# EAGLE design Attiny43u_devboard (EAGLE 6.4)
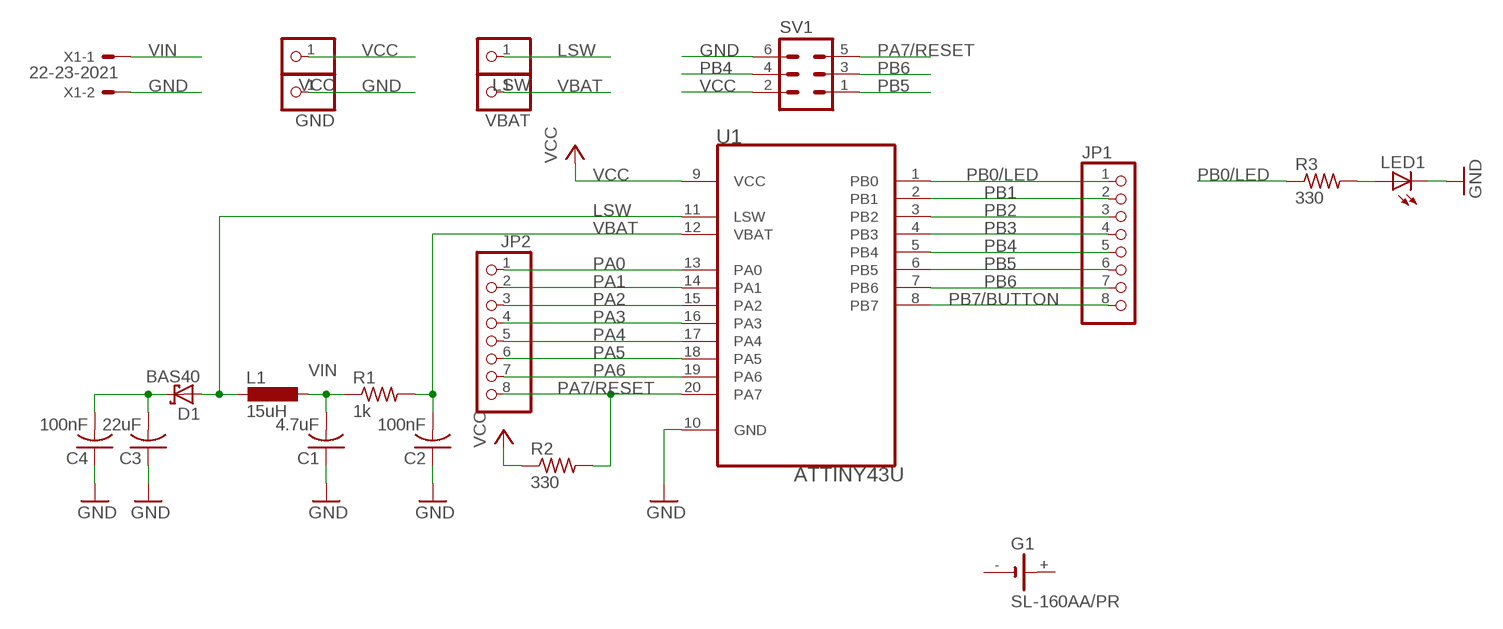
[diagram p0: schematic, sheet 1]

## Parts
C1  4.7uF  C-USC1206K  [C1206K]
C2  100nF  C-USC1206K  [C1206K]
C3  22uF  C-USC1206K  [C1206K]
C4  100nF  C-USC1206K  [C1206K]
D1  BAS40  [SOT23]
G1  SL-160AA/PR  [SL-160AA/PR]
GND  PINHD-1X1  [1X01]
JP1  PINHD-1X8  [1X08]
JP2  PINHD-1X8  [1X08]
L1  15uH  L-EUL3225M  [L3225M]
LED1  LEDCHIPLED_1206  [CHIPLED_1206]
LSW  PINHD-1X1  [1X01]
R1  1k  R-US_M1206  [M1206]
R2  330  R-US_M1206  [M1206]
R3  330  R-US_M1206  [M1206]
SV1  MA03-2  [MA03-2]
U1  ATTINY43U  ATTINY43U-SU  [SOIC127P1032X265-20N]
VBAT  PINHD-1X1  [1X01]
VCC  PINHD-1X1  [1X01]
X1  22-23-2021  [22-23-2021]

## Nets
GND: C1.1 C2.1 C3.1 C4.1 GND.1 LED1.C SV1.6 U1.10(GND) X1.2
LSW: D1.1(A) L1.2 LSW.1 U1.11(LSW)
N$1: LED1.A R3.2
N$2: C3.2 C4.2 D1.3(C)
PA0: JP2.1 U1.13(PA0)
PA1: JP2.2 U1.14(PA1)
PA2: JP2.3 U1.15(PA2)
PA3: JP2.4 U1.16(PA3)
PA4: JP2.5 U1.17(PA4)
PA5: JP2.6 U1.18(PA5)
PA6: JP2.7 U1.19(PA6)
PA7/RESET: JP2.8 R2.2 SV1.5 U1.20(PA7)
PB0/LED: JP1.1 R3.1 U1.1(PB0)
PB1: JP1.2 U1.2(PB1)
PB2: JP1.3 U1.3(PB2)
PB3: JP1.4 U1.4(PB3)
PB4: JP1.5 SV1.4 U1.5(PB4)
PB5: JP1.6 SV1.1 U1.6(PB5)
PB6: JP1.7 SV1.3 U1.7(PB6)
PB7/BUTTON: JP1.8 U1.8(PB7)
VBAT: C2.2 R1.2 U1.12(VBAT) VBAT.1
VCC: R2.1 SV1.2 U1.9(VCC) VCC.1
VIN: C1.2 L1.1 R1.1 X1.1
Unconnected: G1.+ G1.-

## Library data of the parts
C1-C4 = adafruit:C-US: CAPACITOR, American symbol
D1 = diode:BAS40: Silicon Schottky Diodes General-purpose diode for high-speed switching
G1 = battery:SL-160AA/PR: LI BATTERY Sonnenschein
GND LSW VBAT VCC = pinhead:PINHD-1X1: PIN HEADER
JP1 JP2 = pinhead:PINHD-1X8: PIN HEADER
L1 = resistor:L-EU: INDUCTOR, European symbol
LED1 = adafruit:LED: LED OSRAM: - CHIPLED LG R971, LG N971, LY N971, LG Q971, LY Q971, LO R971, LY R971 LH N974, LH R974 LS Q976, LO Q976, LY Q976 LO Q996 - Hyper CHIPLED LW Q18S LB Q993, LB Q99A, LB R99A - SideLED LS A670, LO A670, LY A670, LG A670, LP A670 LB A673, LV A673, LT A673, LW A673 LH A674 LY A675 LS A676, LA A676, LO A676, LY A676, LW A676 LS A679, LY A679, LG A679 - Hyper Micro SIDELED® LS Y876, LA Y876, LO Y876, LY Y876 LT Y87S - SmartLED LW L88C, LW L88S LB L89C, LB L89S, LG L890 LS L89K, LO L89K, LY L89K LS L896, LA L896, LO L896, LY L896 - TOPLED LS T670, LO T670, LY T670, LG T670, LP T670 LSG T670, LSP T670, LSY T670, LOP T670, LYG T670 LG T671, LOG T671, LSG T671 LB T673, LV T673, LT T673, LW T673 LH T674 LS T676, LA T676, LO T676, LY T676, LB T676, LH T676, LSB T676, LW T676 LB T67C, LV T67C, LT T67C, LS T67K, LO T67K, LY T67K, LW E67C LS E67B, LA E67B, LO E67B, LY E67B, LB E67C, LV E67C, LT E67C LW T67C LS T679, LY T679, LG T679 LS T770, LO T770, LY T770, LG T770, LP T770 LB T773, LV T773, LT T773, LW T773 LH T774 LS E675, LA E675, LY E675, LS T675 LS T776, LA T776, LO T776, LY T776, LB T776 LHGB T686 LT T68C, LB T68C - Hyper Mini TOPLED® LB M676 - Mini TOPLED Santana® LG M470 LS M47K, LO M47K, LY M47K Source: http://www.osram.convergy.de/
R1-R3 = adafruit:R-US_: RESISTOR, American symbol
SV1 = con-lstb:MA03-2: PIN HEADER; OC_FARNELL: unknown; OC_NEWARK: unknown
U1 = Atmel_By_element14_Batch_1:ATTINY43U-SU: 8-bit Microcontroller with In-System Programmable Flash and Boost Converter; MPN: ATTINY43U-SU; OC_FARNELL: 1841623; OC_NEWARK: 12T1338; PACKAGE: SOIC-20; SUPPLIER: Atmel
X1 = con-molex:22-23-2021: .100" (2.54mm) Center Header - 2 Pin; MF: MOLEX; MPN: 22-23-2021; OC_FARNELL: 1462926; OC_NEWARK: 25C3832

## Board
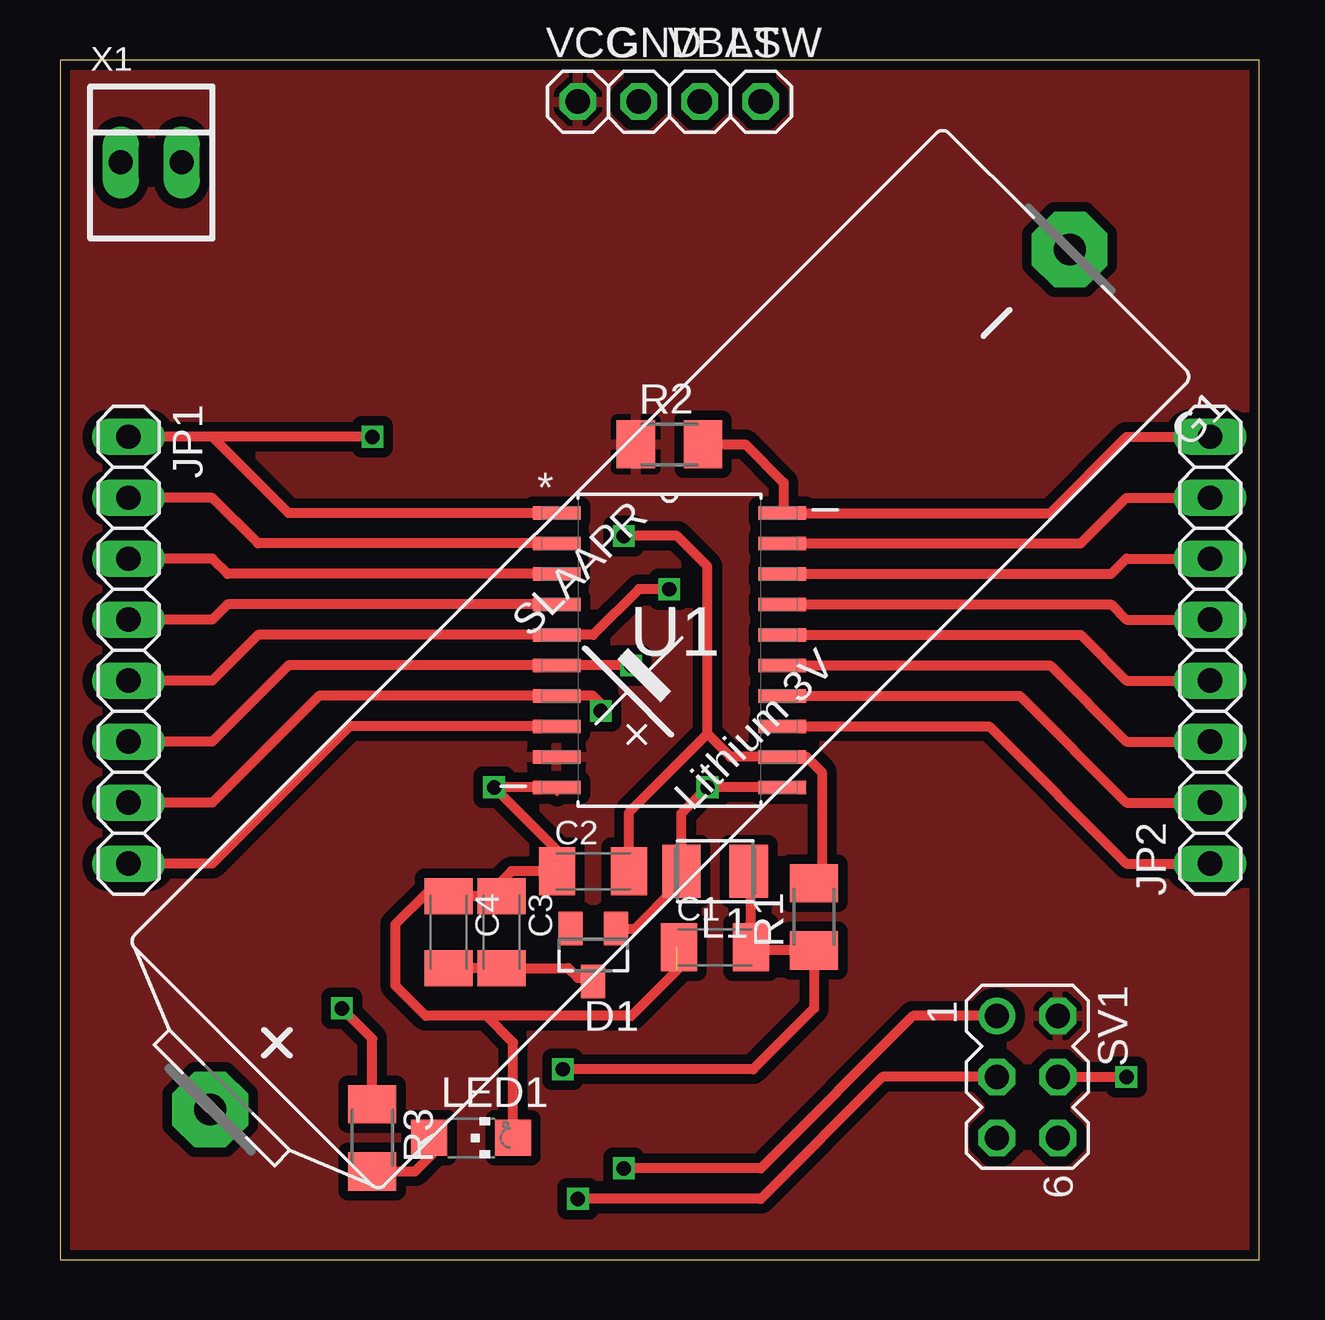
[diagram p1: board, top side]
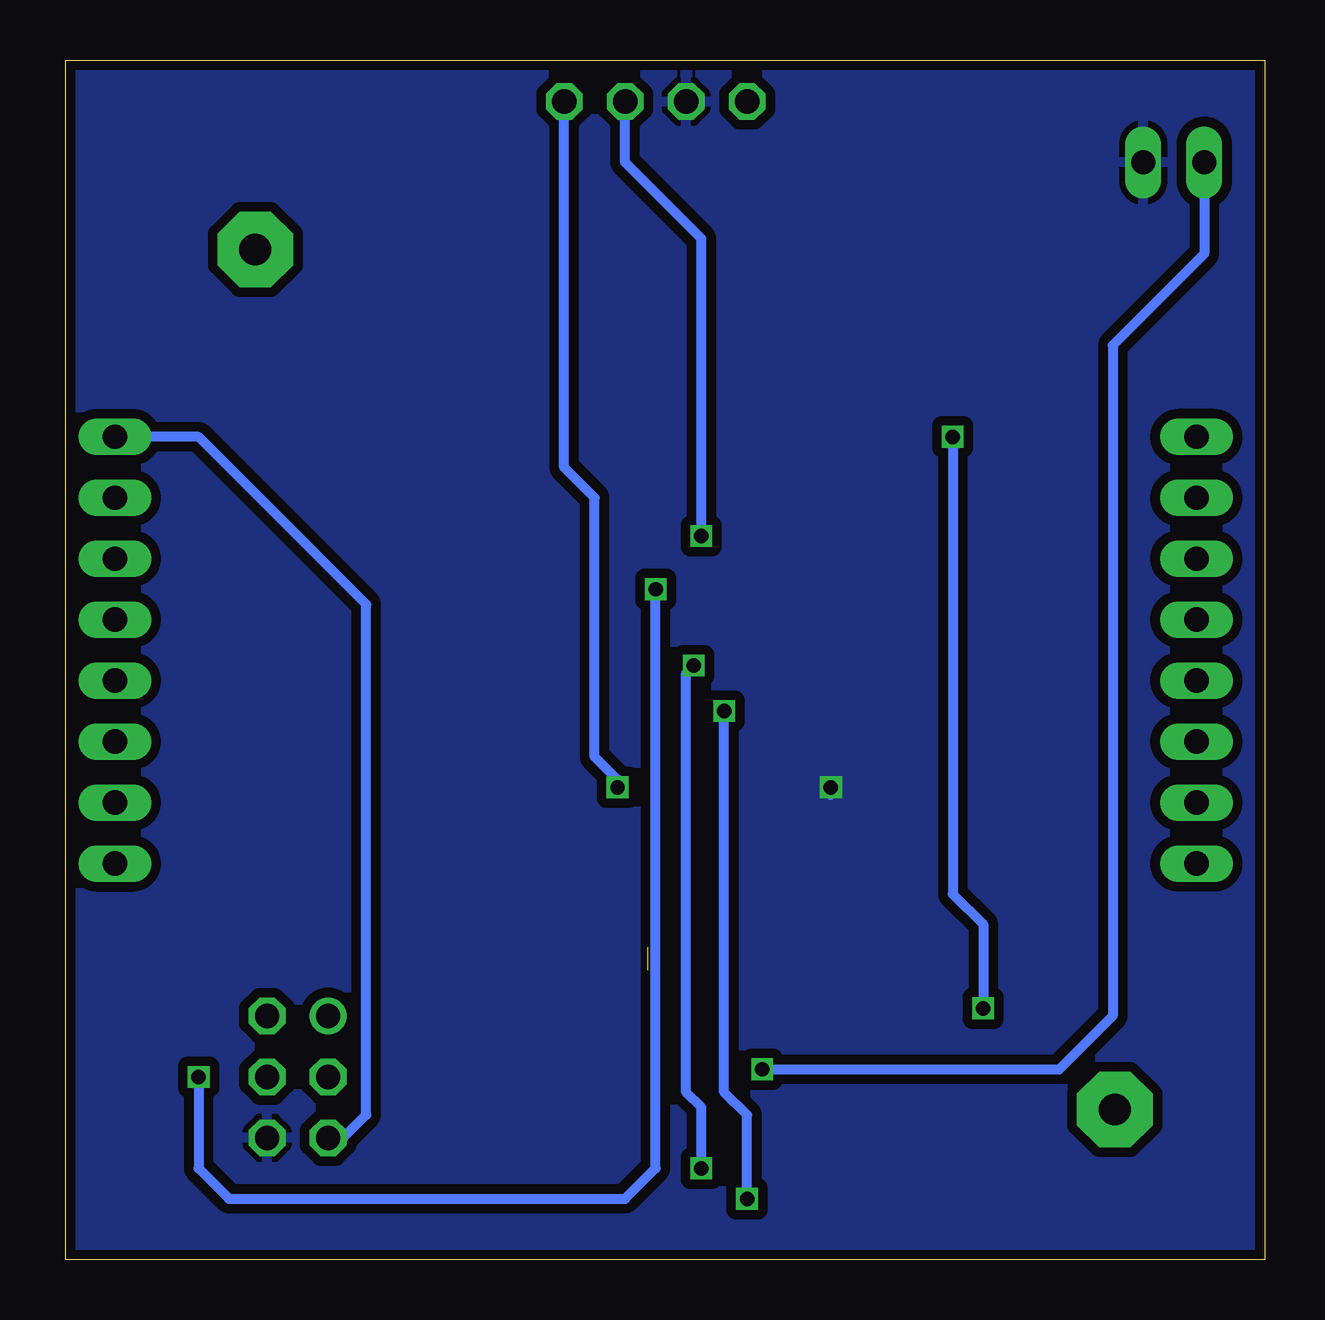
[diagram p2: board, bottom side, seen from below]

Size 49.99 x 49.99 mm. Coordinates in mm from the lower left corner, seen from the top.
Outline: 0,0 49.99,0 49.99,49.99 0,49.99 0,0
Copper layers (1*16): Top 0.035mm / dielectric 1.5mm / Bottom 0.035mm
Design rules "dirt_cheap_dirty_boards.v1": minimum track width 5mil, minimum drill 12mil, track to track 5mil, track to pad 5mil, pad to pad 5mil, via to via 5mil, smd to smd 0mil, copper to edge 10mil, drill to drill 10mil, minimum pad ring 10mil, minimum via ring 6mil, stop-mask expansion 2mil, vias tented up to drill 25mil, thermal gap 10mil
vRestrict: area 21.6,18.7 to 29.2,31.4

### Footprints (pad centres in the part's own frame; a part is rotated, then mirrored left to right if it is on the bottom)
C1206K = smd 1.5 x 2: 1 -1.5,0; 2 1.5,0
SOT23 = smd 1 x 1.4: 1 -0.95,-1.1; 2 0.95,-1.1; 3 0,1.1
SL-160AA/PR = drill 1.321 pad 3.15 octagon: + 25.273,0; - -25.4,0
1X01 = drill 1.016 octagon: 1 0,0
1X08 = drill 1.016 long: 1 -8.89,0; 2 -6.35,0; 3 -3.81,0; 4 -1.27,0; 5 1.27,0; 6 3.81,0; 7 6.35,0; 8 8.89,0
L3225M = smd 1.6 x 2.2: 1 -1.4,0; 2 1.4,0
CHIPLED_1206 = smd 1.5 x 1.5: A 0,-1.75; C 0,1.75
M1206 = smd 1.6 x 2: 1 -1.4,0; 2 1.4,0
MA03-2 = drill 1.016: 1 -2.54,-1.27 | drill 1.016 octagon: 2 -2.54,1.27; 3 0,-1.27; 4 0,1.27; 5 2.54,-1.27; 6 2.54,1.27
SOIC127P1032X265-20N = smd 1.981 x 0.559: 1 -4.699,5.715; 2 -4.699,4.445; 3 -4.699,3.175; 4 -4.699,1.905; 5 -4.699,0.635; 6 -4.699,-0.635; 7 -4.699,-1.905; 8 -4.699,-3.175; 9 -4.699,-4.445; 10 -4.699,-5.715; 11 4.699,-5.715; 12 4.699,-4.445; 13 4.699,-3.175; 14 4.699,-1.905; 15 4.699,-0.635; 16 4.699,0.635; 17 4.699,1.905; 18 4.699,3.175; 19 4.699,4.445; 20 4.699,5.715
22-23-2021 = drill 1 long: 1 -1.27,0; 2 1.27,0

### Placement (x,y rotation side)
C1  27.3,13.02 0 top
C2  22.23,16.19 0 top
C3  18.41,13.65 270 top
C4  16.19,13.65 270 top
D1  22.23,12.7 180 top
G1  24.13,24.13 225 top
GND  24.13,48.26 0 top
JP1  2.86,25.4 270 top
JP2  47.94,25.4 90 top
L1  27.3,16.19 180 top
LED1  17.14,5.08 270 top
LSW  29.21,48.26 0 top
R1  31.43,14.29 90 top
R2  25.4,33.97 0 top
R3  13.02,5.08 270 top
SV1  40.32,7.62 270 top
U1  25.4,25.4 0 top
VBAT  26.67,48.26 0 top
VCC  21.59,48.26 0 top
X1  3.81,45.72 0 top

### Tracks (layer width: path | path; a pad name or v marks a point on that pad's centre or on a via)
GND  (via drill 0.6)  (1 unrouted)
  Top 0.127: 20.73,19.36 U1.10
  Top 0.406: U1.10 v18.1,19.68 20.73,17.06 C2.1 18.82,16.19 17.78,15.15 | C3.1 17.78,15.15 | 17.78,15.15 C4.1 16.11,15.24 15.24,15.24 13.97,13.97 13.97,11.43 15.24,10.16 17.78,10.16 | C1.1 25.73,13.02 | LED1.C 18.89,9.04 17.78,10.16 | 25.73,12.07 23.81,10.16 17.78,10.16
  Bottom 0.406: v18.1,19.68 18.1,19.37
  pour Bottom (isolate 0.406): 0,0 0,49.99 49.99,49.99 49.99,0
LSW  (via drill 0.6)
  Top 0.406: U1.11 v26.99,19.68 25.91,18.6 L1.2 25.72,16 25.72,15.56 23.96,13.8 D1.1
  Bottom 0.406: LSW.1 29.21,33.02 27.94,31.75 27.94,20.95 26.99,20 v26.99,19.68
N$1
  Top 0.406: R3.2 14.79,3.68 15.56,4.45 15.56,4.92 LED1.A
N$2
  Top 0.406: C4.2 C3.2 21.18,12.15 21.59,11.75 22.08,11.75 D1.3
PA0
  Top 0.406: U1.13 38.73,22.23 44.45,16.51 JP2.1
PA1
  Top 0.406: U1.14 40.01,23.5 44.45,19.05 JP2.2
PA2
  Top 0.406: U1.15 41.27,24.77 44.45,21.59 JP2.3
PA3
  Top 0.406: U1.16 42.55,26.04 44.45,24.13 JP2.4
PA4
  Top 0.406: U1.17 43.81,27.3 44.45,26.67 JP2.5
PA5
  Top 0.406: U1.18 43.81,28.57 44.45,29.21 JP2.6
PA6
  Top 0.406: U1.19 42.55,29.84 44.45,31.75 JP2.7
PA7/RESET
  Top 0.406: JP2.8 44.45,34.29 41.27,31.11 U1.20 30.16,31.18 30.16,32.38 28.57,33.97 R2.2
  Bottom 0.406: SV1.5 38.42,5.08 37.47,6.03 37.47,27.3 44.45,34.29 JP2.8
PB0/LED  (via drill 0.6)
  Top 0.406: U1.1 9.53,31.11 6.35,34.29 | 6.35,34.29 JP1.1 | v13.02,34.29 6.35,34.29 | R3.1 13.02,9.21 v11.75,10.48
  Bottom 0.406: v13.02,34.29 13.02,15.24 11.75,13.97 v11.75,10.48
PB1
  Top 0.406: U1.2 8.26,29.84 6.35,31.75 JP1.2
PB2
  Top 0.406: U1.3 6.99,28.57 6.35,29.21 JP1.3
PB3
  Top 0.406: U1.4 6.99,27.3 6.35,26.67 JP1.4
PB4  (via drill 0.6)
  Top 0.406: JP1.5 6.35,24.13 8.26,26.04 U1.5 22.23,26.04 24.13,27.94 v25.4,27.94 | SV1.4 v44.45,7.62
  Bottom 0.406: v44.45,7.62 44.45,3.81 43.18,2.54 26.67,2.54 25.4,3.81 v25.4,27.94
PB5  (via drill 0.6)
  Top 0.406: JP1.6 6.35,21.59 9.53,24.77 U1.6 v23.81,24.77 | SV1.1 35.56,10.16 29.21,3.81 v23.5,3.81
  Bottom 0.406: v23.5,3.81 23.5,6.35 24.13,6.99 24.13,24.45 v23.81,24.77
PB6  (via drill 0.6)
  Top 0.406: JP1.7 6.35,19.05 10.79,23.5 U1.7 22.23,23.5 22.54,23.18 v22.54,22.86 | SV1.3 34.29,7.62 29.21,2.54 v21.59,2.54
  Bottom 0.406: v21.59,2.54 21.59,6.03 22.54,6.99 v22.54,22.86
PB7/BUTTON
  Top 0.406: U1.8 12.06,22.23 6.35,16.51 JP1.8
VBAT  (via drill 0.6)
  Top 0.406: 26.99,21.91 27.94,20.95 U1.12 31.11,20.95 31.75,20.32 31.75,16 R1.2 | C2.2 23.73,18.64 26.99,21.91 | 26.99,21.91 26.99,28.89 25.72,30.16 v23.5,30.16
  Bottom 0.406: v23.5,30.16 23.5,42.55 26.67,45.72 VBAT.1
VCC
  pour Top (isolate 0.406): 0,0 0,49.99 49.99,49.99 49.99,0
VIN  (via drill 0.6)
  Top 0.406: L1.1 28.8,16.09 C1.2 28.93,12.89 R1.1 31.43,10.48 28.89,7.94 v20.95,7.94
  Bottom 0.406: X1.1 2.54,41.91 6.35,38.1 6.35,10.16 8.57,7.94 v20.95,7.94